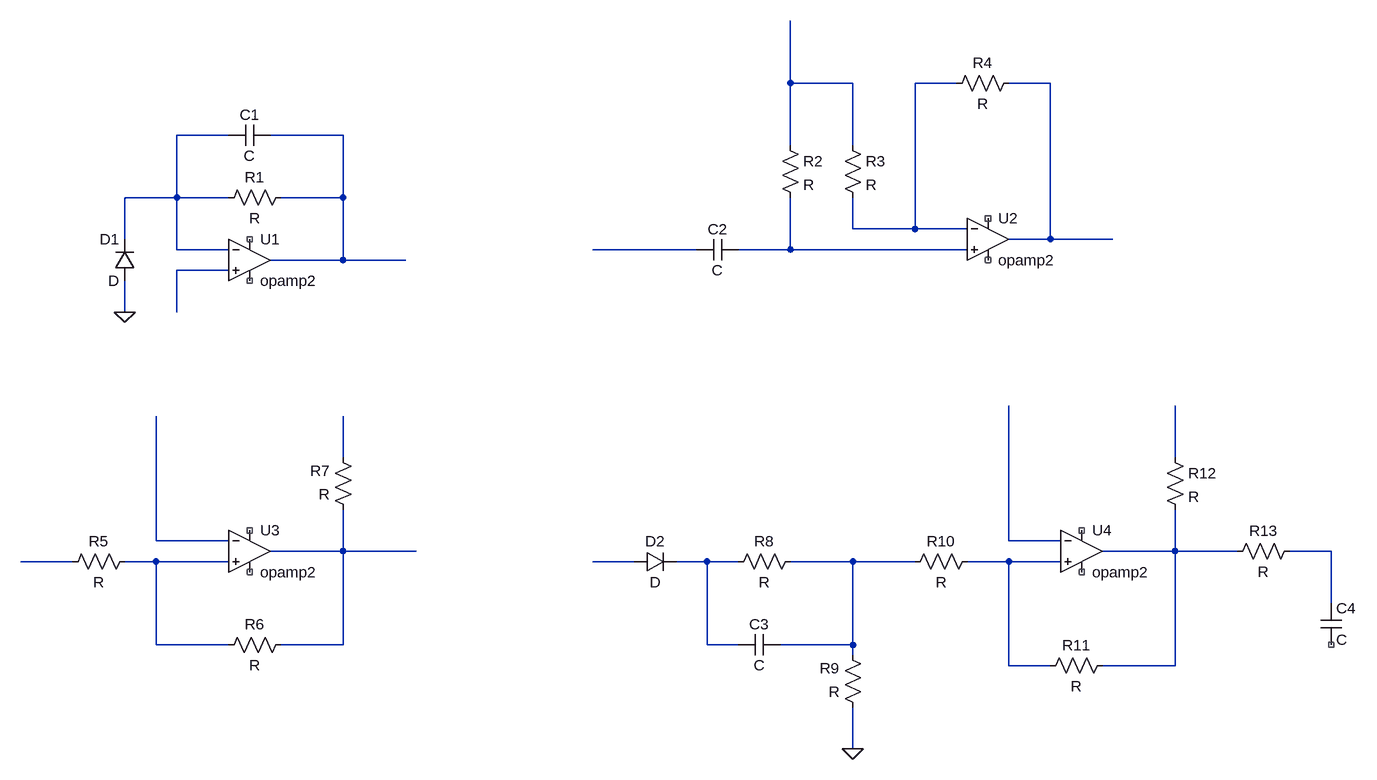
[diagram p0: schematic Phase-3-hardware-design.asc]
Phase-3-hardware-design.asc, the LTspice schematic file:
Version 4
SHEET 1 1976 900
WIRE 1104 -144 1104 -240
WIRE 1200 -144 1104 -144
WIRE 1360 -144 1296 -144
WIRE 1504 -144 1440 -144
WIRE 240 -64 160 -64
WIRE 416 -64 304 -64
WIRE 1104 -48 1104 -144
WIRE 1200 -48 1200 -144
WIRE 160 32 160 -64
WIRE 160 32 80 32
WIRE 240 32 160 32
WIRE 416 32 416 -64
WIRE 416 32 320 32
WIRE 1200 80 1200 32
WIRE 1296 80 1296 -144
WIRE 1296 80 1200 80
WIRE 1376 80 1296 80
WIRE 80 96 80 32
WIRE 1504 96 1504 -144
WIRE 1504 96 1440 96
WIRE 1600 96 1504 96
WIRE 160 112 160 32
WIRE 240 112 160 112
WIRE 960 112 800 112
WIRE 1104 112 1104 32
WIRE 1104 112 1024 112
WIRE 1376 112 1104 112
WIRE 416 128 416 32
WIRE 416 128 304 128
WIRE 512 128 416 128
WIRE 240 144 160 144
WIRE 80 208 80 160
WIRE 160 208 160 144
WIRE 416 432 416 368
WIRE 1696 432 1696 352
WIRE 128 560 128 368
WIRE 240 560 128 560
WIRE 1440 560 1440 352
WIRE 1520 560 1440 560
WIRE 416 576 416 512
WIRE 416 576 304 576
WIRE 528 576 416 576
WIRE 1696 576 1696 512
WIRE 1696 576 1584 576
WIRE 1792 576 1696 576
WIRE 1936 576 1872 576
WIRE 0 592 -80 592
WIRE 128 592 80 592
WIRE 240 592 128 592
WIRE 864 592 800 592
WIRE 976 592 928 592
WIRE 1024 592 976 592
WIRE 1200 592 1104 592
WIRE 1296 592 1200 592
WIRE 1440 592 1376 592
WIRE 1520 592 1440 592
WIRE 1936 656 1936 576
WIRE 128 720 128 592
WIRE 240 720 128 720
WIRE 416 720 416 576
WIRE 416 720 320 720
WIRE 976 720 976 592
WIRE 1024 720 976 720
WIRE 1200 720 1200 592
WIRE 1200 720 1088 720
WIRE 1200 736 1200 720
WIRE 1440 752 1440 592
WIRE 1504 752 1440 752
WIRE 1696 752 1696 576
WIRE 1696 752 1584 752
WIRE 1200 880 1200 816
FLAG 80 208 0
FLAG 1200 880 0
SYMBOL diode 96 160 R180
WINDOW 0 24 64 Left 2
WINDOW 3 24 0 Left 2
SYMATTR InstName D1
SYMBOL cap 304 -80 R90
WINDOW 0 0 32 VBottom 2
WINDOW 3 32 32 VTop 2
SYMATTR InstName C1
SYMBOL res 336 16 R90
WINDOW 0 0 56 VBottom 2
WINDOW 3 32 56 VTop 2
SYMATTR InstName R1
SYMBOL OpAmps\\opamp2 272 64 R0
SYMATTR InstName U1
SYMBOL res 1088 -64 R0
SYMATTR InstName R2
SYMBOL res 1184 -64 R0
SYMATTR InstName R3
SYMBOL OpAmps\\opamp2 1408 32 R0
SYMATTR InstName U2
SYMBOL res 1456 -160 R90
WINDOW 0 0 56 VBottom 2
WINDOW 3 32 56 VTop 2
SYMATTR InstName R4
SYMBOL cap 1024 96 R90
WINDOW 0 0 32 VBottom 2
WINDOW 3 32 32 VTop 2
SYMATTR InstName C2
SYMBOL OpAmps\\opamp2 272 512 R0
SYMATTR InstName U3
SYMBOL res 336 704 R90
WINDOW 0 0 56 VBottom 2
WINDOW 3 32 56 VTop 2
SYMATTR InstName R6
SYMBOL res 96 576 R90
WINDOW 0 0 56 VBottom 2
WINDOW 3 32 56 VTop 2
SYMATTR InstName R5
SYMBOL res 432 528 R180
WINDOW 0 36 76 Left 2
WINDOW 3 36 40 Left 2
SYMATTR InstName R7
SYMBOL res 1120 576 R90
WINDOW 0 0 56 VBottom 2
WINDOW 3 32 56 VTop 2
SYMATTR InstName R8
SYMBOL res 1216 832 R180
WINDOW 0 36 76 Left 2
WINDOW 3 36 40 Left 2
SYMATTR InstName R9
SYMBOL cap 1088 704 R90
WINDOW 0 0 32 VBottom 2
WINDOW 3 32 32 VTop 2
SYMATTR InstName C3
SYMBOL diode 864 608 R270
WINDOW 0 32 32 VTop 2
WINDOW 3 0 32 VBottom 2
SYMATTR InstName D2
SYMBOL res 1392 576 R90
WINDOW 0 0 56 VBottom 2
WINDOW 3 32 56 VTop 2
SYMATTR InstName R10
SYMBOL res 1600 736 R90
WINDOW 0 0 56 VBottom 2
WINDOW 3 32 56 VTop 2
SYMATTR InstName R11
SYMBOL OpAmps\\opamp2 1552 512 R0
SYMATTR InstName U4
SYMBOL cap 1920 656 R0
SYMATTR InstName C4
SYMBOL res 1680 416 R0
SYMATTR InstName R12
SYMBOL res 1888 560 R90
WINDOW 0 0 56 VBottom 2
WINDOW 3 32 56 VTop 2
SYMATTR InstName R13

The netlist it stands for:
* Phase-3-hardware-design.asc
D1 0 N004 D
C1 N005 N004 C
R1 N005 N004 R
XU1 N008 N004 NC_01 NC_02 N005 opamp2  ; pins In+ In- V+ V- OUT
R2 N001 N007 R
R3 N001 N002 R
XU2 N007 N002 NC_03 NC_04 N003 opamp2  ; pins In+ In- V+ V- OUT
R4 N003 N002 R
C2 N007 N006 C
XU3 N017 N011 NC_05 NC_06 N013 opamp2  ; pins In+ In- V+ V- OUT
R6 N013 N017 R
R5 N017 N016 R
R7 N013 N009 R
R8 N020 N019 R
R9 0 N020 R
C3 N020 N019 C
D2 N018 N019 D
R10 N021 N020 R
R11 N014 N021 R
XU4 N021 N012 NC_07 NC_08 N014 opamp2  ; pins In+ In- V+ V- OUT
C4 N015 NC_09 C
R12 N010 N014 R
R13 N015 N014 R
.model D D
.lib standard.dio
.backanno
.end